# EAGLE design bat-off-on-threshold-voltage.v1 (EAGLE 8.3.1)
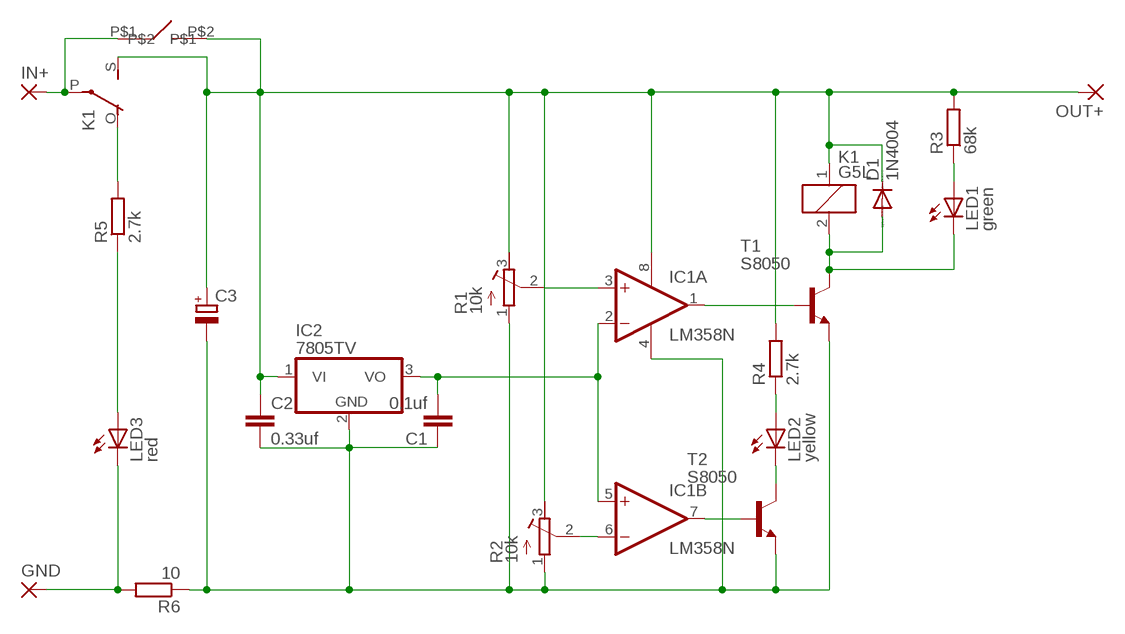
[diagram p0: schematic, sheet 1]

## Parts
C1  0.1uf  C-EU050-025X075  [C050-025X075]
C2  0.33uf  C-EU050-025X075  [C050-025X075]
C3  CPOL-EUE2.5-6  [E2,5-6]
D1  1N4004  [DO41-10]
GND  3,81/1,1  [3,81/1,1]
IC1  LM358N  [DIL08]
IC2  7805TV  [TO220V]
IN+  3,81/1,1  [3,81/1,1]
K1  G5L  [G5LE]
LED1  green  LED3MM  [LED3MM]
LED2  yellow  LED3MM  [LED3MM]
LED3  red  LED3MM  [LED3MM]
OUT+  3,81/1,1  [3,81/1,1]
R1  10k  R-TRIMM3296W  [RTRIM3296W]
R2  10k  R-TRIMM3296W  [RTRIM3296W]
R3  68k  R-EU_0204/7  [0204/7]
R4  2.7k  R-EU_0204/7  [0204/7]
R5  2.7k  R-EU_0204/7  [0204/7]
R6  10  R-EU_0204/7  [0204/7]
T1  S8050  -NPN-TO92-EBC  [TO92-EBC]
T2  S8050  -NPN-TO92-EBC  [TO92-EBC]
U$1  BTN-6X6  [BTN-6X6]

## Nets
GND: C1.1 C2.2 C3.- IC1.4(P:V-) IC2.2(GND) R1.1(A) R2.1(A) R6.1 T1.E T2.E
N$1: IC1.1(A:OUT) T1.B
N$2: IC1.7(B:OUT) T2.B
N$3: IC1.3(A:+IN) R1.2(S)
N$5: IC1.6(B:-IN) R2.2(S)
N$6: C2.1 C3.+ D1.C IC1.8(P:V+) IC2.1(VI) K1.1 K1.S(2:S) OUT+.1(P) R1.3(E) R2.3(E) R3.2 R4.2 U$1.P$2
N$7: C1.2 IC1.2(A:-IN) IC1.5(B:+IN) IC2.3(VO)
N$8: LED1.A R3.1
N$9: D1.A K1.2 LED1.K(C) T1.C
N$10: LED2.K(C) T2.C
N$11: LED2.A R4.1
N$12: IN+.1(P) K1.P(2:P) U$1.P$1
N$15: LED3.A R5.1
N$16: K1.O(2:O) R5.2
N$18: GND.1(P) LED3.K(C) R6.2

## Library data of the parts
C1 C2 = resistor:C-EU: CAPACITOR, European symbol
C3 = resistor:CPOL-EU: POLARIZED CAPACITOR, European symbol
D1 = diode:1N4004: DIODE general purpose rectifier, 1 A
GND IN+ OUT+ = wirepad:3,81/1,1: THROUGH-HOLE PAD
IC1 = linear:LM358: OP AMP also LM158; LM258; LM2904 Source: http://cache.national.com/ds/LM/LM158.pdf
IC2 = linear:78*: Positive VOLTAGE REGULATOR Source: http://cache.national.com/ds/LM/LM78L05.pdf http://www.fairchildsemi.com/ds/LM/LM7805.pdf
K1 = relay:G5L: RELAY 1 x switch, 10 A/120 V AC, 8 A/30 V ADC, Omron; OC_FARNELL: unknown; OC_NEWARK: unknown
LED1-LED3 = led:LED: LED OSRAM: - CHIPLED LG R971, LG N971, LY N971, LG Q971, LY Q971, LO R971, LY R971 LH N974, LH R974 LS Q976, LO Q976, LY Q976 LO Q996 - Hyper CHIPLED LW Q18S LB Q993, LB Q99A, LB R99A - SideLED LS A670, LO A670, LY A670, LG A670, LP A670 LB A673, LV A673, LT A673, LW A673 LH A674 LY A675 LS A676, LA A676, LO A676, LY A676, LW A676 LS A679, LY A679, LG A679 - Hyper Micro SIDELED® LS Y876, LA Y876, LO Y876, LY Y876 LT Y87S - SmartLED LW L88C, LW L88S LB L89C, LB L89S, LG L890 LS L89K, LO L89K, LY L89K LS L896, LA L896, LO L896, LY L896 - TOPLED LS T670, LO T670, LY T670, LG T670, LP T670 LSG T670, LSP T670, LSY T670, LOP T670, LYG T670 LG T671, LOG T671, LSG T671 LB T673, LV T673, LT T673, LW T673 LH T674 LS T676, LA T676, LO T676, LY T676, LB T676, LH T676, LSB T676, LW T676 LB T67C, LV T67C, LT T67C, LS T67K, LO T67K, LY T67K, LW E67C LS E67B, LA E67B, LO E67B, LY E67B, LB E67C, LV E67C, LT E67C LW T67C LS T679, LY T679, LG T679 LS T770, LO T770, LY T770, LG T770, LP T770 LB T773, LV T773, LT T773, LW T773 LH T774 LS E675, LA E675, LY E675, LS T675 LS T776, LA T776, LO T776, LY T776, LB T776 LHGB T686 LT T68C, LB T68C - Hyper Mini TOPLED® LB M676 - Mini TOPLED Santana® LG M470 LS M47K, LO M47K, LY M47K Source: http://www.osram.convergy.de LUXEON: - LUMILED® LXK2-PW12-R00, LXK2-PW12-S00, LXK2-PW14-U00, LXK2-PW14-V00 LXK2-PM12-R00, LXK2-PM12-S00, LXK2-PM14-U00 LXK2-PE12-Q00, LXK2-PE12-R00, LXK2-PE12-S00, LXK2-PE14-T00, LXK2-PE14-U00 LXK2-PB12-K00, LXK2-PB12-L00, LXK2-PB12-M00, LXK2-PB14-N00, LXK2-PB14-P00, LXK2-PB14-Q00 LXK2-PR12-L00, LXK2-PR12-M00, LXK2-PR14-Q00, LXK2-PR14-R00 LXK2-PD12-Q00, LXK2-PD12-R00, LXK2-PD12-S00 LXK2-PH12-R00, LXK2-PH12-S00 LXK2-PL12-P00, LXK2-PL12-Q00, LXK2-PL12-R00 Source: www.luxeon.com KINGBRIGHT: KA-3528ASYC Source: www.kingbright.com
R1 R2 = resistor:R-TRIMM: Trimm resistor
R3-R6 = resistor:R-EU_: RESISTOR, European symbol
T1 T2 = transistor:*-NPN-: NPN Transistror BF959 corrected 2008.03.06
U$1 = mgvc:BTN-6X6

## Board
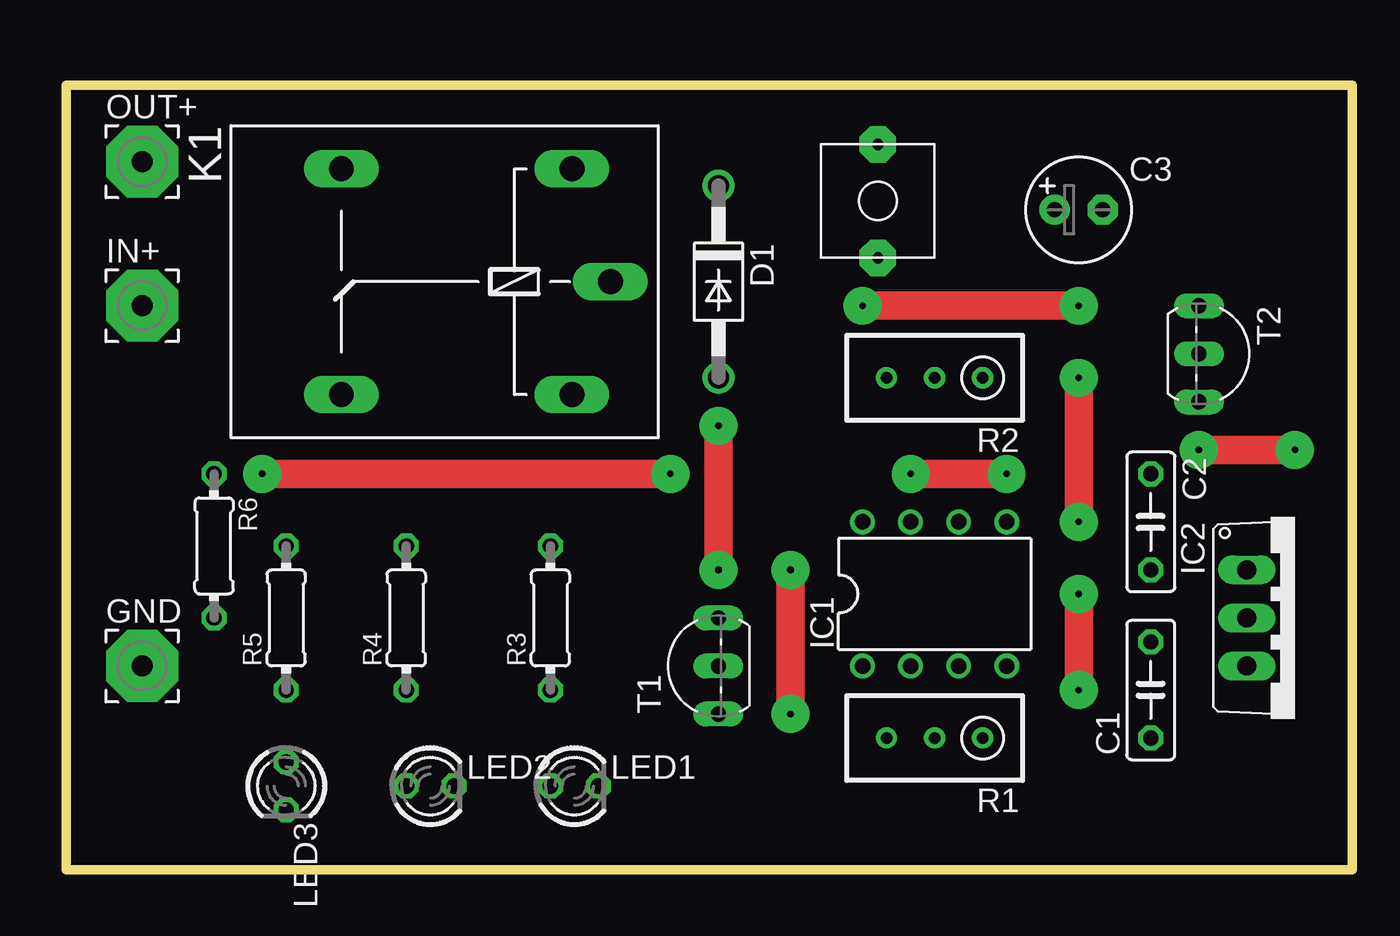
[diagram p1: board, top side]
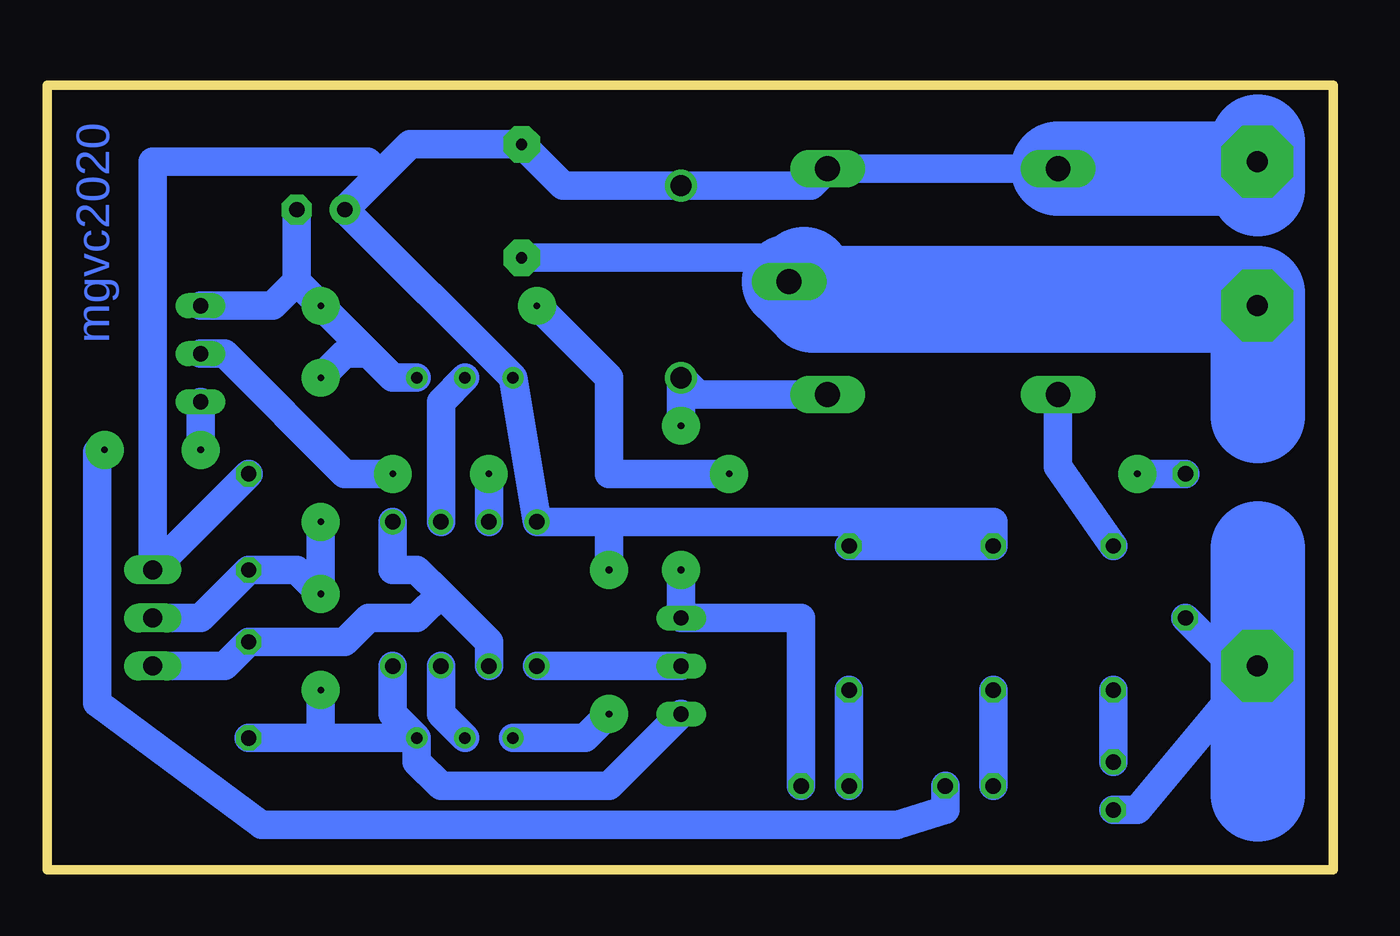
[diagram p2: board, bottom side, seen from below]

Size 68 x 41.5 mm. Coordinates in mm from the lower left corner, seen from the top.
Outline: 0,41.5 0,0 68,0 68,41.5 0,41.5
Copper layers (1*16): Top 0.035mm / dielectric 1.5mm / Bottom 0.035mm
Design rules "default *": minimum track width 1mm, minimum drill 0.35mm, track to track 6mil, track to pad 6mil, pad to pad 6mil, via to via 6mil, smd to smd 6mil, copper to edge 40mil, drill to drill 6mil, minimum pad ring 10mil, minimum via ring 8mil, stop-mask expansion 4mil, vias tented up to drill 0mil, thermal gap 10mil

### Footprints (pad centres in the part's own frame; a part is rotated, then mirrored left to right if it is on the bottom)
C050-025X075 = drill 0.813 octagon: 1 -2.54,0; 2 2.54,0
E2,5-6 = drill 0.813 pad 1.6: + -1.27,0 | drill 0.813 pad 1.6 octagon: - 1.27,0
DO41-10 = drill 1.118: A 5.08,0; C -5.08,0
3,81/1,1 = drill 1.118 pad 3.81 octagon: 1 0,0
DIL08 = drill 0.813 pad 1.27: 1 -3.81,-3.81; 2 -1.27,-3.81; 3 1.27,-3.81; 4 3.81,-3.81; 5 3.81,3.81; 6 1.27,3.81; 7 -1.27,3.81; 8 -3.81,3.81
TO220V = drill 1.016 long: 1 -2.54,-2.54; 2 0,-2.54; 3 2.54,-2.54
G5LE = drill 1.321 long: 1 -7.493,-5.969; 2 -7.493,5.969; O 4.699,5.969; P -9.525,0; S 4.699,-5.969
LED3MM = drill 0.813 octagon: A -1.27,0; K 1.27,0
RTRIM3296W = drill 0.61: 1 0,-2.54; 2 0,0; 3 0,2.54
0204/7 = drill 0.813 octagon: 1 -3.81,0; 2 3.81,0
TO92-EBC = drill 0.813 long: B 0,-1.27; C 2.54,-1.27; E -2.54,-1.27
BTN-6X6 = drill 0.6 pad 1.93 octagon: P$1 0,3; P$2 6,3

### Placement (x,y rotation side)
C1  57.35,9.51 90 top
C2  57.35,18.4 270 top
C3  53.54,34.91 0 top
D1  34.49,31.1 270 top
GND  4.01,10.78 0 top
IC1  45.92,14.59 0 top
IC2  64.97,13.32 270 top
IN+  4.01,29.83 0 top
K1  19.25,31.1 180 top
LED1  26.87,4.43 0 top
LED2  19.25,4.43 0 top
LED3  11.63,4.43 270 top
OUT+  4.01,37.45 0 top
R1  45.92,6.97 90 top
R2  45.92,26.02 90 top
R3  25.6,13.32 90 top
R4  17.98,13.32 90 top
R5  11.63,13.32 90 top
R6  7.82,17.13 270 top
T1  33.22,10.78 90 top
T2  61.16,27.29 270 top
U$1  45.92,32.37 90 top

### Tracks (layer width: path | path; a pad name or v marks a point on that pad's centre or on a via)
GND  (via drill 0.35 pad 2)
  Top 1.5: v10.36,20.94 v31.95,20.94 | v42.11,29.83 v53.54,29.83 | v53.54,26.02 v53.54,18.4 | v53.54,14.59 v53.54,9.51
  Bottom 1.5: IC1.4 49.73,8.24 R1.1 | IC2.2 59.89,13.32 C2.2 54.81,15.86 v53.54,14.59 v53.54,18.4 | 53.37,6.97 C1.1 | 53.37,6.97 R1.1 | v31.95,20.94 38.3,20.94 38.3,26.02 v42.11,29.83 | 54.81,31.1 C3.- | 54.81,31.1 v53.54,29.83 49.73,26.02 | 49.73,26.02 R2.1 | T2.E 56.08,29.83 54.81,31.1 | R6.1 v10.36,20.94 | T1.E 38.3,4.43 47.19,4.43 48.46,5.7 R1.1 | v53.54,26.02 52.27,27.29 51,27.29 49.73,26.02 | v53.54,9.51 53.54,7.14 53.37,6.97
N$1
  Bottom 1.5: T1.B IC1.1
N$2  (via drill 0.35 pad 2)
  Top 1.5: v44.65,20.94 v49.73,20.94
  Bottom 1.5: IC1.7 v44.65,20.94 | T2.B 58.62,27.29 52.27,20.94 v49.73,20.94
N$3
  Bottom 1.5: IC1.3 47.19,8.24 R1.2
N$4
  Bottom 5: 4,4 4,17
N$5
  Bottom 1.5: IC1.6 47.19,24.75 R2.2
N$6  (via drill 0.35 pad 2)
  Top 1.5: v38.3,8.24 v38.3,15.86
  Bottom 1.5: K1.S K1.1 27.63,36.18 D1.C 40.73,36.18 U$1.P$2 48.81,38.37 50.4,36.78 | 50.4,36.78 C3.+ R2.3 IC1.8 38.3,18.4 | R1.3 39.57,6.97 v38.3,8.24 | v38.3,15.86 38.3,18.4 | 50.4,36.78 51.08,37.45 62.43,37.45 IC2.1 C2.1 | R3.2 R4.2 17.98,18.4 38.3,18.4
  Bottom 5: K1.S 4.39,37.07 OUT+.1
N$7
  Bottom 1.5: IC2.3 58.62,10.78 C1.2 52.27,12.05 51,13.32 48.46,13.32 47.19,14.59 | IC1.2 44.65,12.05 47.19,14.59 | 47.19,14.59 48.46,15.86 49.73,15.86 IC1.5
N$8
  Bottom 1.5: R3.1 LED1.A
N$9  (via drill 0.35 pad 2)
  Top 1.5: v34.49,23.48 v34.49,15.86
  Bottom 1.5: K1.2 33.6,25.13 D1.A v34.49,23.48 | LED1.K 28.14,13.32 T1.C v34.49,15.86
N$10  (via drill 0.35 pad 2)
  Top 1.5: v59.89,22.21 v64.97,22.21
  Bottom 1.5: LED2.K 20.52,3.16 23.06,2.39 56.66,2.39 65.36,8.82 65.36,22.1 v64.97,22.21 | T2.C v59.89,22.21
N$11
  Bottom 1.5: R4.1 LED2.A
N$12
  Bottom 1.5: U$1.P$1 30.05,32.37 K1.P
  Bottom 5: IN+.1 27.51,29.83 K1.P
N$13
  Bottom 5: 4,30 4,24
N$14
  Bottom 5: 4,38.5 4,37.5 4,36
N$15
  Bottom 1.5: R5.1 LED3.A
N$16
  Bottom 1.5: K1.O 14.55,21.32 R5.2
N$17
  Bottom 5: 28,31.5 28,30.5 4,30.5
N$18
  Bottom 1.5: R6.2 5.28,10.78 GND.1 10.36,3.16 LED3.K

### Text on the board
Bottom: mgvc2020